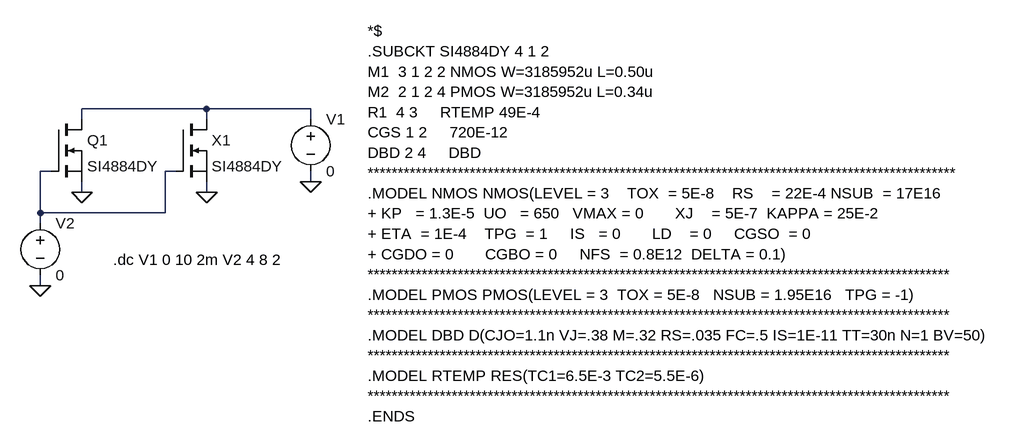
[diagram p0: schematic 4884.asc]
4884.asc, the LTspice schematic file:
Version 4
SHEET 1 2364 736
WIRE 992 160 800 160
WIRE 1152 160 992 160
WIRE 800 176 800 160
WIRE 992 176 992 160
WIRE 1152 176 1152 160
WIRE 752 256 736 256
WIRE 944 256 928 256
WIRE 1152 272 1152 256
WIRE 800 288 800 272
WIRE 992 288 992 272
WIRE 736 320 736 256
WIRE 928 320 928 256
WIRE 928 320 736 320
WIRE 736 336 736 320
WIRE 736 432 736 416
FLAG 992 288 0
FLAG 800 288 0
FLAG 736 432 0
FLAG 1152 272 0
SYMBOL nmos 944 176 R0
SYMATTR InstName X1
SYMATTR Value SI4884DY
SYMATTR Prefix X
SYMBOL nmos 752 176 R0
SYMATTR InstName Q1
SYMATTR Value SI4884DY
SYMBOL voltage 1152 160 R0
SYMATTR InstName V1
SYMATTR Value 0
SYMBOL voltage 736 320 R0
SYMATTR InstName V2
SYMATTR Value 0
TEXT 848 392 Left 0 !.dc V1 0 10 2m V2 4 8 2
TEXT 1240 40 Left 0 !*$\n.SUBCKT SI4884DY 4 1 2\nM1  3 1 2 2 NMOS W=3185952u L=0.50u \nM2  2 1 2 4 PMOS W=3185952u L=0.34u\nR1  4 3     RTEMP 49E-4\nCGS 1 2     720E-12\nDBD 2 4     DBD\n**************************************************************************************************\n.MODEL NMOS NMOS(LEVEL = 3    TOX  = 5E-8    RS    = 22E-4 NSUB  = 17E16\n+ KP   = 1.3E-5  UO   = 650   VMAX = 0       XJ    = 5E-7  KAPPA = 25E-2\n+ ETA  = 1E-4    TPG  = 1     IS   = 0       LD    = 0     CGSO  = 0\n+ CGDO = 0       CGBO = 0     NFS  = 0.8E12  DELTA = 0.1)\n*************************************************************************************************\n.MODEL PMOS PMOS(LEVEL = 3  TOX = 5E-8   NSUB = 1.95E16   TPG = -1) \n*************************************************************************************************\n.MODEL DBD D(CJO=1.1n VJ=.38 M=.32 RS=.035 FC=.5 IS=1E-11 TT=30n N=1 BV=50)\n*************************************************************************************************\n.MODEL RTEMP RES(TC1=6.5E-3 TC2=5.5E-6)\n*************************************************************************************************\n.ENDS

The netlist it stands for:
* 4884.asc
XX1 N001 N002 0 SI4884DY  ; pins D G S
M§Q1 N001 N002 0 0 SI4884DY
V1 N001 0 0
V2 N002 0 0
.model NMOS NMOS
.model PMOS PMOS
.lib standard.mos
.dc V1 0 10 2m V2 4 8 2
*$
.SUBCKT SI4884DY 4 1 2
M1  3 1 2 2 NMOS W=3185952u L=0.50u
M2  2 1 2 4 PMOS W=3185952u L=0.34u
R1  4 3     RTEMP 49E-4
CGS 1 2     720E-12
DBD 2 4     DBD
**************************************************************************************************
.MODEL NMOS NMOS(LEVEL = 3    TOX  = 5E-8    RS    = 22E-4 NSUB  = 17E16
+ KP   = 1.3E-5  UO   = 650   VMAX = 0       XJ    = 5E-7  KAPPA = 25E-2
+ ETA  = 1E-4    TPG  = 1     IS   = 0       LD    = 0     CGSO  = 0
+ CGDO = 0       CGBO = 0     NFS  = 0.8E12  DELTA = 0.1)
*************************************************************************************************
.MODEL PMOS PMOS(LEVEL = 3  TOX = 5E-8   NSUB = 1.95E16   TPG = -1)
*************************************************************************************************
.MODEL DBD D(CJO=1.1n VJ=.38 M=.32 RS=.035 FC=.5 IS=1E-11 TT=30n N=1 BV=50)
*************************************************************************************************
.MODEL RTEMP RES(TC1=6.5E-3 TC2=5.5E-6)
*************************************************************************************************
.ENDS
.backanno
.end